# Altium schematic sheet Sheet1.SchDoc
size A4
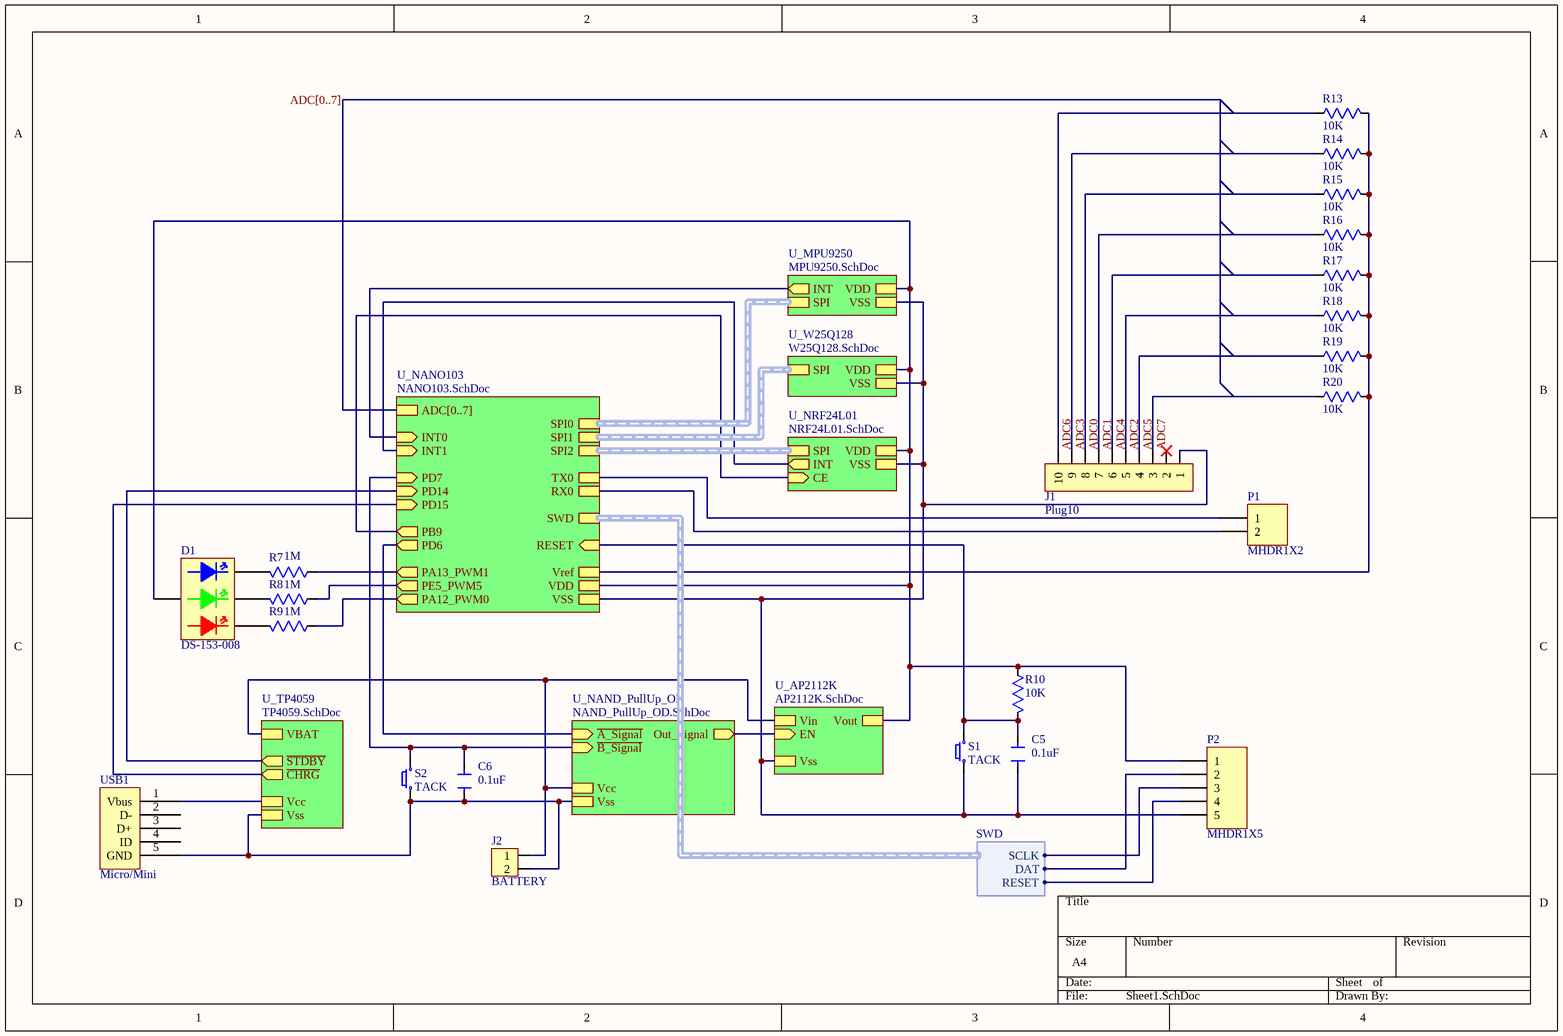
[diagram p0: Sheet1.SchDoc]

## Parts
C5  value 0.1uF  [CAP_0402]  (hidden comment: Cap)
C6  value 0.1uF  [CAP_0402]  (hidden comment: Cap)
D1  DS-153-008  [LED_RGB_0603]
J1  Plug10  [FPC0.5-10PS]
J2  BATTERY  [Terminal_block_2pin_1.25mm_SMD]
P1  MHDR1X2  [MHDR1X2]
P2  MHDR1X5  [MHDR1X5]
R7  value 1M  [RES_0402]  (hidden comment: Res)
R8  value 1M  [RES_0402]  (hidden comment: Res)
R9  value 1M  [RES_0402]  (hidden comment: Res)
R10  value 10K  [RES_0402]  (hidden comment: Res)
R13  value 10K  [RES_0402]  (hidden comment: Res)
R14  value 10K  [RES_0402]  (hidden comment: Res)
R15  value 10K  [RES_0402]  (hidden comment: Res)
R16  value 10K  [RES_0402]  (hidden comment: Res)
R17  value 10K  [RES_0402]  (hidden comment: Res)
R18  value 10K  [RES_0402]  (hidden comment: Res)
R19  value 10K  [RES_0402]  (hidden comment: Res)
R20  value 10K  [RES_0402]  (hidden comment: Res)
S1  TACK  [TACK-SW_SMD 2P 4x3mm_2]
S2  TACK  [TACK-SW_SMD 2P 4x3mm_2]
USB1  Micro/Mini  [USB_Micro-B_S_SMT]

## Sub-sheets
U_AP2112K = AP2112K.SchDoc: EN (in), Vin, Vout, Vss
U_MPU9250 = MPU9250.SchDoc: SPI (harness SPI), VDD, VSS, INT (out)
U_NAND_PullUp_OD = NAND_PullUp_OD.SchDoc: ~{A_Signal} (in), Out_Signal (out), ~{B_Signal} (in), Vcc, Vss
U_NANO103 = NANO103.SchDoc: ADC[0..7], SPI0 (harness SPI), SPI1 (harness SPI), SPI2 (harness SPI), INT0 (in), INT1 (in), PD15 (in), PD14 (in), PD7 (in), TX0, RX0, SWD (harness SWD), VDD, VSS, PB9 (out), PD6 (out), PA12_PWM0 (out), PA13_PWM1 (out), PE5_PWM5 (out), Vref, RESET (in)
U_NRF24L01 = NRF24L01.SchDoc: VDD, VSS, INT (out), CE (in), SPI (harness SPI)
U_TP4059 = TP4059.SchDoc: ~{CHRG} (out), ~{STDBY} (out), Vss, Vcc, VBAT
U_W25Q128 = W25Q128.SchDoc: SPI (harness SPI), VDD, VSS

## Harnesses
SWD: DAT, RESET, SCLK

## Nets
ADC0: J1.8 R15.2
ADC1: J1.7 R16.2
ADC2: J1.5 R18.2
ADC3: J1.9 R14.2
ADC4: J1.6 R17.2
ADC5: J1.4 R19.2
ADC6: J1.10 R13.2
ADC7: J1.3 R20.2
NetC5_1: C5.1 R10.1 S1.1 ; sheet U_NANO103/RESET
NetC5_2: C5.2 J1.1 P2.5 S1.2 ; sheet U_AP2112K/Vss, sheet U_MPU9250/VSS, sheet U_NANO103/VSS, sheet U_W25Q128/VSS, sheet U_NRF24L01/VSS
NetC6_1: C6.1 S2.1 ; sheet U_NAND_PullUp_OD/~{B_Signal}, sheet U_NANO103/PD7
NetC6_2: C6.2 J2.2 S2.2 USB1.5(GND) ; sheet U_NAND_PullUp_OD/Vss, sheet U_TP4059/Vss
NetD1_1: D1.1(G) R8.1
NetD1_2: D1.2(B) R7.1
NetD1_3: D1.3(Anode) P2.1 R10.2 ; sheet U_AP2112K/Vout, sheet U_MPU9250/VDD, sheet U_NANO103/VDD, sheet U_W25Q128/VDD, sheet U_NRF24L01/VDD
NetD1_4: D1.4(R) R9.1
NetJ2_1: J2.1 ; sheet U_AP2112K/Vin, sheet U_NAND_PullUp_OD/Vcc, sheet U_TP4059/VBAT
NetP1_1: P1.1 ; sheet U_NANO103/TX0
NetP1_2: P1.2 ; sheet U_NANO103/RX0
NetP2_2: P2.2 ; sheet U_NANO103/SWD.DAT
NetP2_3: P2.3 ; sheet U_NANO103/SWD.SCLK
NetP2_4: P2.4 ; sheet U_NANO103/SWD.RESET
NetR7_2: R7.2 ; sheet U_NANO103/PA13_PWM1
NetR8_2: R8.2 ; sheet U_NANO103/PE5_PWM5
NetR9_2: R9.2 ; sheet U_NANO103/PA12_PWM0
NetR13_1: R13.1 R14.1 R15.1 R16.1 R17.1 R18.1 R19.1 R20.1 ; sheet U_NANO103/Vref
NetUSB1_1: USB1.1(Vbus) ; sheet U_TP4059/Vcc
(unnamed): sheet U_AP2112K/EN, sheet U_NAND_PullUp_OD/Out_Signal
(unnamed): sheet U_NAND_PullUp_OD/~{A_Signal}, sheet U_NANO103/PD6
(unnamed): sheet U_TP4059/~{CHRG}, sheet U_NANO103/PD15
(unnamed): sheet U_TP4059/~{STDBY}, sheet U_NANO103/PD14
(unnamed): sheet U_MPU9250/INT, sheet U_NANO103/INT0
(unnamed): sheet U_NANO103/INT1, sheet U_NRF24L01/INT
(unnamed): sheet U_NANO103/PB9, sheet U_NRF24L01/CE

Not connected (* = marked no-connect by the designer): J1 2*; USB1 2(D-) 3(D+) 4(ID)

## Buses and harness runs
bus ADC[0..7] = sheet U_NANO103/ADC[0..7]
harness sheet U_MPU9250/SPI = sheet U_NANO103/SPI0
harness sheet U_NANO103/SPI1 = sheet U_W25Q128/SPI
harness sheet U_NANO103/SPI2 = sheet U_NRF24L01/SPI

## Library data of the parts
J2 = Plug2
P1 = MHDR1X2: Header, 2-Pin; LatestRevisionDate: 17-Jul-2002; LatestRevisionNote: Re-released for DXP Platform.; Publisher: Altium Limited
P2 = MHDR1X5: Header, 5-Pin; LatestRevisionDate: 17-Jul-2002; LatestRevisionNote: Re-released for DXP Platform.; Publisher: Altium Limited
S1 S2 = Switch_Button1
USB1 = USB2